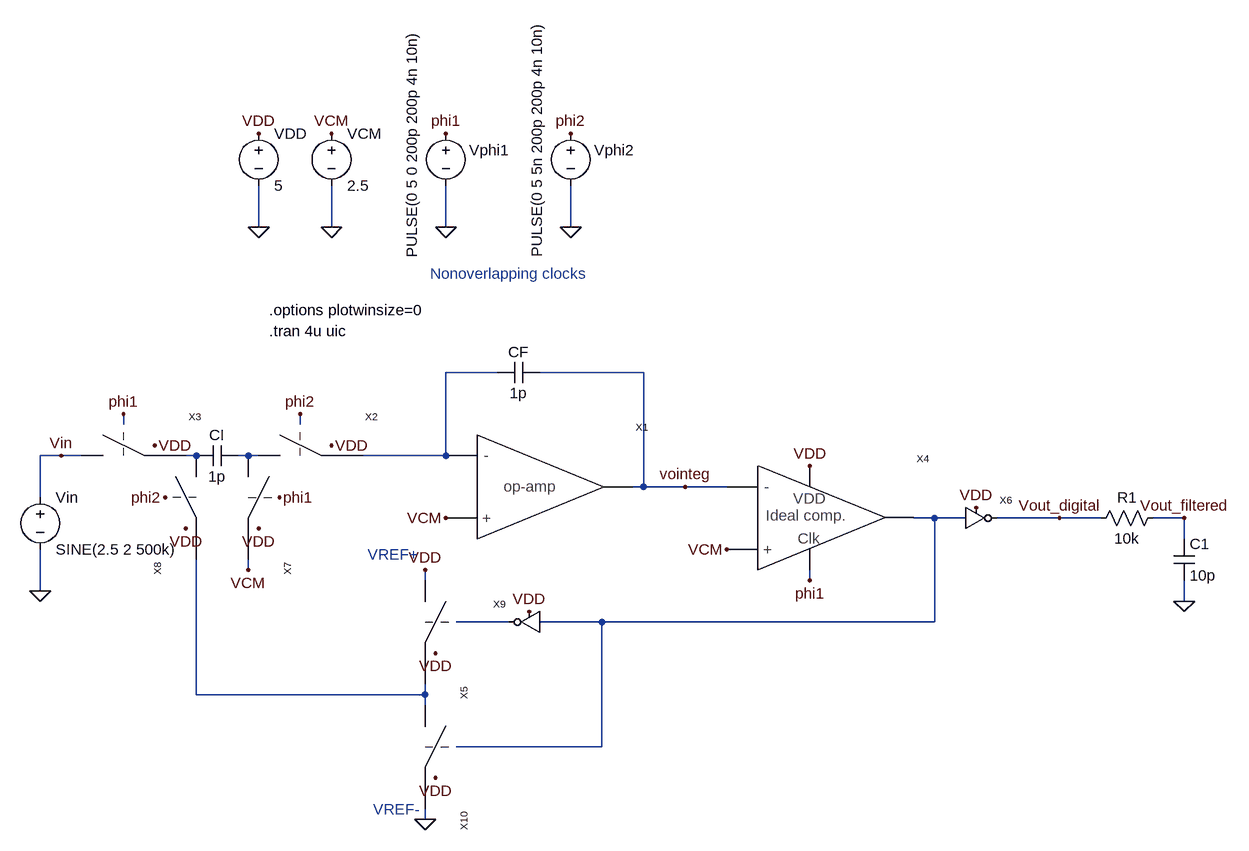
[diagram p0: schematic Fig29_47.asc]
Fig29_47.asc, the LTspice schematic file:
Version 4
SHEET 1 2740 696
WIRE 1040 -720 1040 -784
WIRE 1152 -720 1152 -784
WIRE 1328 -720 1328 -784
WIRE 1520 -720 1520 -784
WIRE 1408 -496 1328 -496
WIRE 1632 -496 1472 -496
WIRE 832 -416 832 -432
WIRE 1104 -416 1104 -432
WIRE 736 -368 704 -368
WIRE 768 -368 736 -368
WIRE 944 -368 928 -368
WIRE 1024 -368 1008 -368
WIRE 1040 -368 1024 -368
WIRE 1328 -368 1328 -496
WIRE 1328 -368 1200 -368
WIRE 1632 -320 1632 -496
WIRE 1632 -320 1616 -320
WIRE 1696 -320 1632 -320
WIRE 1760 -320 1696 -320
WIRE 704 -304 704 -368
WIRE 2080 -272 2048 -272
WIRE 2128 -272 2080 -272
WIRE 2272 -272 2176 -272
WIRE 2336 -272 2272 -272
WIRE 2464 -272 2416 -272
WIRE 2464 -240 2464 -272
WIRE 1024 -192 1024 -208
WIRE 1296 -176 1296 -192
WIRE 1888 -176 1888 -192
WIRE 704 -160 704 -224
WIRE 2464 -144 2464 -176
WIRE 1424 -112 1344 -112
WIRE 1568 -112 1472 -112
WIRE 2080 -112 2080 -272
WIRE 2080 -112 1568 -112
WIRE 944 0 944 -208
WIRE 1296 0 1296 -16
WIRE 1296 0 944 0
WIRE 1296 16 1296 0
WIRE 1568 80 1568 -112
WIRE 1568 80 1344 80
WIRE 1296 192 1296 176
FLAG 704 -160 0
FLAG 736 -368 Vin
FLAG 1328 -720 0
FLAG 1328 -864 phi1
FLAG 1040 -720 0
FLAG 1040 -864 VDD
FLAG 1152 -384 VDD
FLAG 832 -432 phi1
FLAG 1104 -432 phi2
FLAG 1520 -720 0
FLAG 1520 -864 phi2
FLAG 1152 -720 0
FLAG 1152 -864 VCM
FLAG 1760 -224 VCM
FLAG 1888 -352 VDD
FLAG 1888 -176 phi1
FLAG 2272 -272 Vout_digital
FLAG 1696 -320 vointeg
FLAG 2144 -288 VDD
FLAG 1328 -272 VCM
FLAG 1040 -256 VDD
FLAG 880 -384 VDD
FLAG 928 -256 VDD
FLAG 896 -304 phi2
FLAG 1072 -304 phi1
FLAG 1312 -64 VDD
FLAG 1456 -128 VDD
FLAG 1296 -192 VDD
FLAG 1024 -192 VCM
FLAG 1312 128 VDD
FLAG 1296 192 0
FLAG 2464 -144 0
FLAG 2464 -272 Vout_filtered
SYMBOL voltage 704 -320 R0
WINDOW 123 0 0 Left 0
WINDOW 39 0 0 Left 0
SYMATTR InstName Vin
SYMATTR Value SINE(2.5 2 500k)
SYMBOL voltage 1328 -880 R0
WINDOW 0 36 42 Left 0
WINDOW 3 -52 207 VLeft 0
WINDOW 123 0 0 Left 0
WINDOW 39 0 0 Left 0
SYMATTR InstName Vphi1
SYMATTR Value PULSE(0 5 0 200p 200p 4n 10n)
SYMBOL voltage 1040 -880 R0
WINDOW 123 0 0 Left 0
WINDOW 39 0 0 Left 0
SYMATTR InstName VDD
SYMATTR Value 5
SYMBOL cap 1408 -480 R270
WINDOW 0 32 32 VTop 0
WINDOW 3 0 32 VBottom 0
SYMATTR InstName CF
SYMATTR Value 1p
SYMBOL cap 1008 -384 R90
WINDOW 0 0 32 VBottom 0
WINDOW 3 32 32 VTop 0
SYMATTR InstName CI
SYMATTR Value 1p
SYMBOL voltage 1520 -880 R0
WINDOW 0 36 42 Left 0
WINDOW 3 -52 207 VLeft 0
WINDOW 123 0 0 Left 0
WINDOW 39 0 0 Left 0
SYMATTR InstName Vphi2
SYMATTR Value PULSE(0 5 5n 200p 200p 4n 10n)
SYMBOL voltage 1152 -880 R0
WINDOW 123 0 0 Left 0
WINDOW 39 0 0 Left 0
SYMATTR InstName VCM
SYMATTR Value 2.5
SYMBOL Ideal_clocked_comparator 1808 -272 R0
SYMATTR InstName X4
SYMBOL inverter 2128 -272 R0
SYMATTR InstName X6
SYMBOL op_amp 1376 -320 R0
SYMATTR InstName X1
SYMBOL switch_1 1040 -352 R0
SYMATTR InstName X2
SYMBOL switch_1 768 -352 R0
SYMATTR InstName X3
SYMBOL switch_1 1008 -368 R90
SYMATTR InstName X7
SYMBOL switch_1 960 -368 M90
SYMATTR InstName X8
SYMBOL switch_1 1280 -176 R90
SYMATTR InstName X5
SYMBOL inverter 1472 -112 M0
SYMATTR InstName X9
SYMBOL switch_1 1280 16 R90
SYMATTR InstName X10
SYMBOL res 2320 -256 R270
WINDOW 0 32 56 VTop 0
WINDOW 3 0 56 VBottom 0
SYMATTR InstName R1
SYMATTR Value 10k
SYMBOL cap 2448 -240 R0
SYMATTR InstName C1
SYMATTR Value 10p
TEXT 1056 -560 Left 0 !.tran 4u uic
TEXT 1304 -648 Left 0 ;Nonoverlapping clocks
TEXT 1056 -592 Left 0 !.options plotwinsize=0
TEXT 1208 -216 Left 0 ;VREF+
TEXT 1216 176 Left 0 ;VREF-

The netlist it stands for:
* Fig29_47.asc
Vin Vin 0 SINE(2.5 2 500k)
Vphi1 phi1 0 PULSE(0 5 0 200p 200p 4n 10n)
VDD VDD 0 5
CF N001 vointeg 1p
CI N003 N002 1p
Vphi2 phi2 0 PULSE(0 5 5n 200p 200p 4n 10n)
VCM VCM 0 2.5
XX4 vointeg VCM N004 VDD phi1 Ideal_clocked_comparator  ; pins Vinm Vinp Vout VDD Clock
XX6 N004 Vout_digital VDD inverter  ; pins In Out VDD
XX1 N001 VCM vointeg op_amp  ; pins Vinm Vinp Out
XX2 N003 N001 phi2 VDD switch_1  ; pins P1 P2 clk VDD
XX3 Vin N002 phi1 VDD switch_1  ; pins P1 P2 clk VDD
XX7 N003 VCM phi1 VDD switch_1  ; pins P1 P2 clk VDD
XX8 N002 N006 phi2 VDD switch_1  ; pins P1 P2 clk VDD
XX5 VDD N006 N005 VDD switch_1  ; pins P1 P2 clk VDD
XX9 N004 N005 VDD inverter  ; pins In Out VDD
XX10 N006 0 N004 VDD switch_1  ; pins P1 P2 clk VDD
R1 Vout_digital Vout_filtered 10k
C1 Vout_filtered 0 10p
.tran 4u uic
* Nonoverlapping clocks
.options plotwinsize=0
* VREF+
* VREF-
.backanno
.end